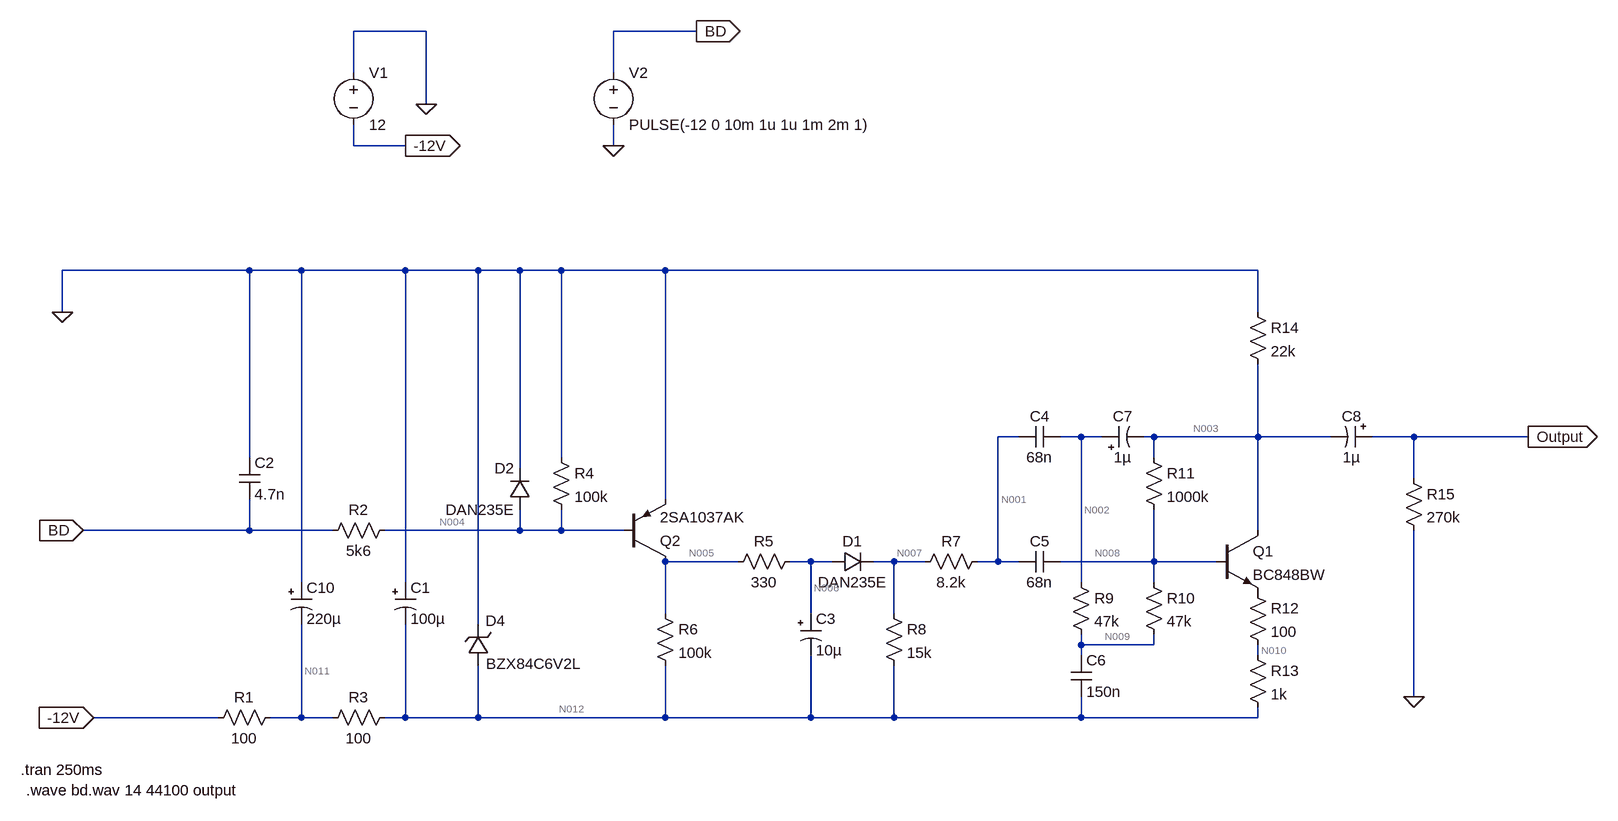
[diagram p0: schematic Bassdrum.asc]
Bassdrum.asc, the LTspice schematic file:
Version 4
SHEET 1 2460 680
WIRE 320 -848 208 -848
WIRE 736 -848 608 -848
WIRE 208 -784 208 -848
WIRE 608 -784 608 -848
WIRE 320 -736 320 -848
WIRE 208 -672 208 -704
WIRE 288 -672 208 -672
WIRE 608 -672 608 -704
WIRE 48 -480 -240 -480
WIRE 128 -480 48 -480
WIRE 288 -480 128 -480
WIRE 400 -480 288 -480
WIRE 464 -480 400 -480
WIRE 528 -480 464 -480
WIRE 688 -480 528 -480
WIRE 1600 -480 688 -480
WIRE -240 -416 -240 -480
WIRE 1600 -416 1600 -480
WIRE 1232 -224 1200 -224
WIRE 1328 -224 1296 -224
WIRE 1360 -224 1328 -224
WIRE 1440 -224 1424 -224
WIRE 1600 -224 1600 -336
WIRE 1600 -224 1440 -224
WIRE 1712 -224 1600 -224
WIRE 1840 -224 1776 -224
WIRE 2016 -224 1840 -224
WIRE 48 -192 48 -480
WIRE 528 -192 528 -480
WIRE 1440 -192 1440 -224
WIRE 464 -176 464 -480
WIRE 1840 -160 1840 -224
WIRE 688 -128 688 -480
WIRE 48 -80 48 -128
WIRE 48 -80 -208 -80
WIRE 176 -80 48 -80
WIRE 464 -80 464 -112
WIRE 464 -80 256 -80
WIRE 528 -80 528 -112
WIRE 528 -80 464 -80
WIRE 624 -80 528 -80
WIRE 1600 -80 1600 -224
WIRE 800 -32 688 -32
WIRE 912 -32 880 -32
WIRE 944 -32 912 -32
WIRE 1040 -32 1008 -32
WIRE 1088 -32 1040 -32
WIRE 1200 -32 1200 -224
WIRE 1200 -32 1168 -32
WIRE 1232 -32 1200 -32
WIRE 1440 -32 1440 -112
WIRE 1440 -32 1296 -32
WIRE 1536 -32 1440 -32
WIRE 128 0 128 -480
WIRE 288 0 288 -480
WIRE 1328 0 1328 -224
WIRE 1440 0 1440 -32
WIRE 688 48 688 -32
WIRE 912 48 912 -32
WIRE 1040 48 1040 -32
WIRE 400 64 400 -480
WIRE 1328 96 1328 80
WIRE 1440 96 1440 80
WIRE 1440 96 1328 96
WIRE 1328 112 1328 96
WIRE 1600 112 1600 96
WIRE 1840 176 1840 -80
WIRE 0 208 -192 208
WIRE 128 208 128 64
WIRE 128 208 80 208
WIRE 176 208 128 208
WIRE 288 208 288 64
WIRE 288 208 256 208
WIRE 400 208 400 128
WIRE 400 208 288 208
WIRE 688 208 688 128
WIRE 688 208 400 208
WIRE 912 208 912 112
WIRE 912 208 688 208
WIRE 1040 208 1040 128
WIRE 1040 208 912 208
WIRE 1328 208 1328 176
WIRE 1328 208 1040 208
WIRE 1600 208 1600 192
WIRE 1600 208 1328 208
FLAG -240 -416 0
FLAG -192 208 -12V
IOPIN -192 208 In
FLAG 288 -672 -12V
IOPIN 288 -672 Out
FLAG 320 -736 0
FLAG 736 -848 BD
IOPIN 736 -848 Out
FLAG 608 -672 0
FLAG -208 -80 BD
IOPIN -208 -80 In
FLAG 1840 176 0
FLAG 2016 -224 Output
IOPIN 2016 -224 Out
SYMBOL res 96 192 R90
WINDOW 0 0 56 VBottom 2
WINDOW 3 32 56 VTop 2
SYMATTR InstName R1
SYMATTR Value 100
SYMBOL cap 32 -192 R0
SYMATTR InstName C2
SYMATTR Value 4.7n
SYMBOL res 272 -96 R90
WINDOW 0 0 56 VBottom 2
WINDOW 3 32 56 VTop 2
SYMATTR InstName R2
SYMATTR Value 5k6
SYMBOL res 272 192 R90
WINDOW 0 0 56 VBottom 2
WINDOW 3 32 56 VTop 2
SYMATTR InstName R3
SYMATTR Value 100
SYMBOL diode 480 -112 R180
WINDOW 0 24 64 Left 2
WINDOW 3 24 0 Left 2
SYMATTR InstName D2
SYMATTR Value DAN235E
SYMBOL res 512 -208 R0
SYMATTR InstName R4
SYMATTR Value 100k
SYMBOL res 1184 -48 R90
WINDOW 0 0 56 VBottom 2
WINDOW 3 32 56 VTop 2
SYMATTR InstName R7
SYMATTR Value 8.2k
SYMBOL cap 1296 -48 R90
WINDOW 0 0 32 VBottom 2
WINDOW 3 32 32 VTop 2
SYMATTR InstName C5
SYMATTR Value 68n
SYMBOL res 1024 32 R0
SYMATTR InstName R8
SYMATTR Value 15k
SYMBOL res 1312 -16 R0
SYMATTR InstName R9
SYMATTR Value 47k
SYMBOL cap 1312 112 R0
SYMATTR InstName C6
SYMATTR Value 150n
SYMBOL res 1424 -16 R0
SYMATTR InstName R10
SYMATTR Value 47k
SYMBOL res 1424 -208 R0
SYMATTR InstName R11
SYMATTR Value 1000k
SYMBOL res 1584 0 R0
SYMATTR InstName R12
SYMATTR Value 100
SYMBOL res 1584 96 R0
SYMATTR InstName R13
SYMATTR Value 1k
SYMBOL res 1824 -176 R0
SYMATTR InstName R15
SYMATTR Value 270k
SYMBOL voltage 208 -800 R0
WINDOW 123 0 0 Left 0
WINDOW 39 0 0 Left 0
SYMATTR InstName V1
SYMATTR Value 12
SYMBOL polcap 112 0 R0
SYMATTR InstName C10
SYMATTR Value 220µ
SYMATTR SpiceLine V=16
SYMBOL polcap 272 0 R0
SYMATTR InstName C1
SYMATTR Value 100µ
SYMATTR SpiceLine V=16
SYMBOL zener 416 128 R180
WINDOW 0 -26 69 Left 2
WINDOW 3 -143 3 Left 2
SYMATTR InstName D4
SYMATTR Value BZX84C6V2L
SYMBOL res 896 -48 R90
WINDOW 0 0 56 VBottom 2
WINDOW 3 32 56 VTop 2
SYMATTR InstName R5
SYMATTR Value 330
SYMBOL polcap 896 48 R0
SYMATTR InstName C3
SYMATTR Value 10µ
SYMATTR SpiceLine V=10
SYMBOL diode 944 -16 R270
WINDOW 0 32 32 VTop 2
WINDOW 3 0 32 VBottom 2
SYMATTR InstName D1
SYMATTR Value DAN235E
SYMBOL cap 1296 -240 R90
WINDOW 0 0 32 VBottom 2
WINDOW 3 32 32 VTop 2
SYMATTR InstName C4
SYMATTR Value 68n
SYMBOL polcap 1360 -208 R270
WINDOW 0 32 32 VTop 2
WINDOW 3 0 32 VBottom 2
SYMATTR InstName C7
SYMATTR Value 1µ
SYMATTR SpiceLine V=25
SYMBOL polcap 1776 -240 R90
WINDOW 0 0 32 VBottom 2
WINDOW 3 32 32 VTop 2
SYMATTR InstName C8
SYMATTR Value 1µ
SYMATTR SpiceLine V=25
SYMBOL npn 1536 -80 R0
SYMATTR InstName Q1
SYMATTR Value BC848BW
SYMBOL res 672 32 R0
SYMATTR InstName R6
SYMATTR Value 100k
SYMBOL res 1584 -432 R0
SYMATTR InstName R14
SYMATTR Value 22k
SYMBOL pnp 624 -32 M180
SYMATTR InstName Q2
SYMATTR Value 2SA1037AK
SYMBOL voltage 608 -800 R0
WINDOW 123 0 0 Left 0
WINDOW 39 0 0 Left 0
SYMATTR InstName V2
SYMATTR Value PULSE(-12 0 10m 1u 1u 1m 2m 1)
TEXT -304 288 Left 2 !.tran 250ms
TEXT -296 320 Left 2 !.wave bd.wav 14 44100 output

The netlist it stands for:
* Bassdrum.asc
R1 N011 -12V 100
C2 0 BD 4.7n
R2 N004 BD 5k6
R3 N012 N011 100
D2 N004 0 DAN235E
R4 0 N004 100k
R7 N001 N007 8.2k
C5 N008 N001 68n
R8 N007 N012 15k
R9 N002 N009 47k
C6 N009 N012 150n
R10 N008 N009 47k
R11 N003 N008 1000k
R12 P001 N010 100
R13 N010 N012 1k
R15 Output 0 270k
V1 0 -12V 12
C10 0 N011 220µ V=16
C1 0 N012 100µ V=16
D4 N012 0 BZX84C6V2L
R5 N006 N005 330
C3 N006 N012 10µ V=10
D1 N006 N007 DAN235E
C4 N002 N001 68n
C7 N002 N003 1µ V=25
C8 Output N003 1µ V=25
Q1 N003 N008 P001 0 BC848BW
R6 N005 N012 100k
R14 0 N003 22k
Q2 N005 N004 0 0 2SA1037AK
V2 BD 0 PULSE(-12 0 10m 1u 1u 1m 2m 1)
.model D D
.lib standard.dio
.model NPN NPN
.model PNP PNP
.lib standard.bjt
.tran 250ms
.wave bd.wav 14 44100 output
.backanno
.end

* Results of the author's LTspice run, read from the files saved beside the schematic
* Operating Point, zero values left out:
*   V(n011) = -9.235 V
*   V(-12v) = -12 V
*   V(bd) = -12 V
*   V(n004) = -666.6 mV
*   V(n012) = -6.469 V
*   V(n001) = -874.7 mV
*   V(n007) = -874.7 mV
*   V(n008) = -5.661 V
*   V(n002) = -5.661 V
*   V(n009) = -5.661 V
*   V(n003) = -4.86 V
*   V(p001) = -6.226 V
*   V(n010) = -6.248 V
*   V(n006) = -138.9 mV
*   V(n005) = -15.77 mV
*   Ic(Q1) = 220.1 µA
*   Ib(Q1) = 800.8 nA
*   Ie(Q1) = -220.9 µA
*   Ic(Q2) = -437.5 µA
*   Ib(Q2) = -2.017 mA
*   Ie(Q2) = 2.455 mA
*   I(D2) = -1.695 pA
*   I(D1) = 373 µA
*   I(D4) = -27 mA
*   I(R1) = 27.65 mA
*   I(R2) = 2.024 mA
*   I(R3) = 27.65 mA
*   I(R4) = 6.666 µA
*   I(R8) = 373 µA
*   I(R11) = 800.8 nA
*   I(R12) = 220.9 µA
*   I(R13) = 220.9 µA
*   I(R5) = -373 µA
*   I(R6) = 64.53 µA
*   I(R14) = 220.9 µA
*   I(V1) = -27.65 mA
*   I(V2) = 2.024 mA
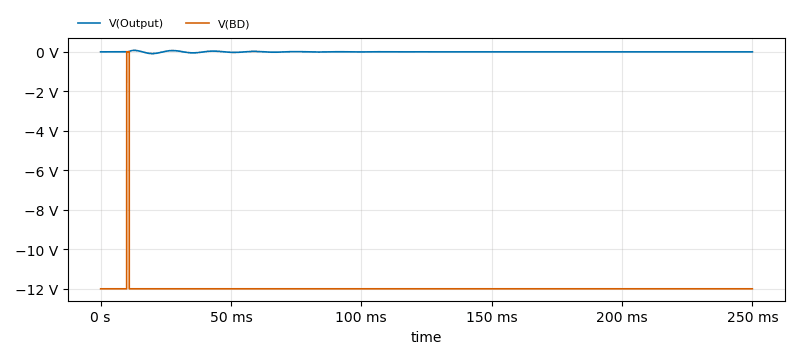
[diagram p1: Transient Analysis of Bassdrum.asc, plotted from the saved traces]
* Transient Analysis, 1 run:
*   V(Output): min -87.52 mV, max 75.83 mV, average 13.72 µV, rms 18.75 mV, last -32.53 µV
*   V(BD): min -12 V, max 0 V, average -11.95 V, rms 11.98 V, last -12 V